# Altium schematic sheet Wireless_thermometer_BLE_module.SchDoc
size A4 portrait; SheetNumber: 1; SheetTotal: 2
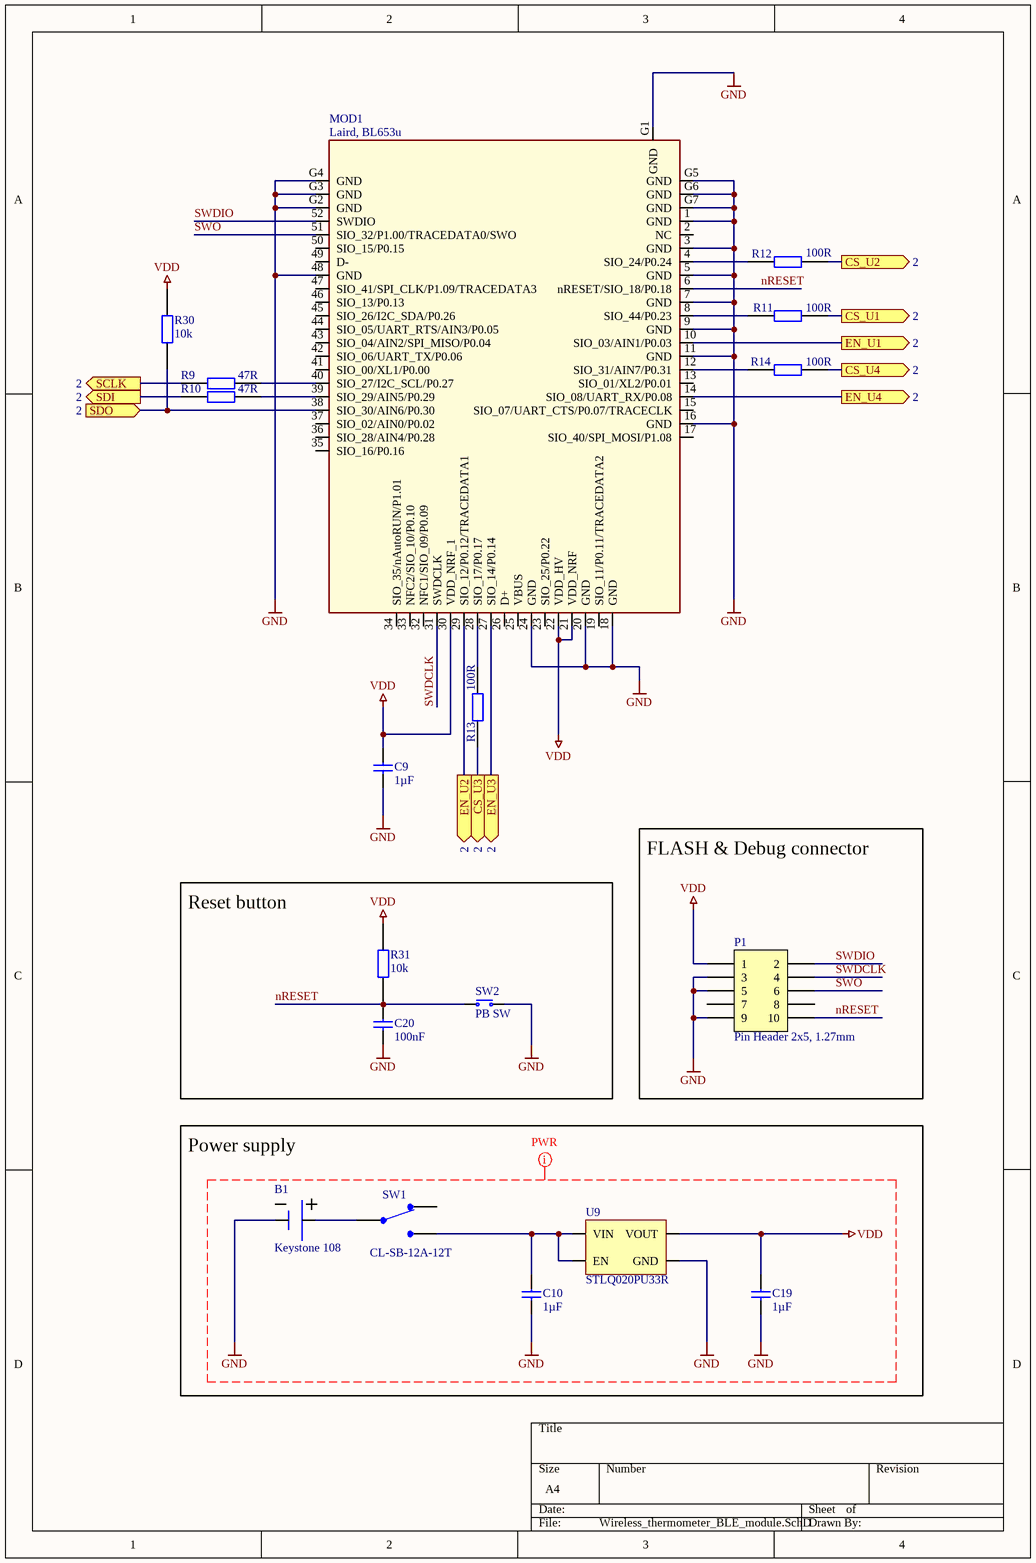
[diagram p0: Wireless_thermometer_BLE_module.SchDoc]

## Parts
B1  Keystone 108  [Keystone 108]
C9  1µF  [CAPC1005X04L]
C10  1µF  [CAPC1005X04L]
C19  1µF  [CAPC1005X04L]
C20  100nF  [CAPC1005X04L]
MOD1  Laird, BL653u  [Laird, BL653u]
P1  Pin Header 2x5, 1.27mm  [HDR_2x5-SMD-1.27mm-K]
R9  47R  [RESC1005X04L]
R10  47R  [RESC1005X04L]
R11  100R  [RESC1005X04L]
R12  100R  [RESC1005X04L]
R13  100R  [RESC1005X04L]
R14  100R  [RESC1005X04L]
R30  10k  [RESC1005X04L]
R31  10k  [RESC1005X04L]
SW1  CL-SB-12A-12T  [CL-SB-12A-12T]
SW2  PB SW  [C&K_PTS810]
U9  STLQ020PU33R  [STLQ020PU33R]

## Ports
CS_U1 (out, see 2), CS_U2 (out, see 2), CS_U3 (out, see 2), CS_U4 (out, see 2), EN_U1 (out, see 2), EN_U2 (out, see 2), EN_U3 (out, see 2), EN_U4 (out, see 2), SCLK (out, see 2), SDI (out, see 2), SDO (in, see 2)

## Nets
GND: B1.2 C9.1 C10.1 C19.1 C20.1 MOD1.1(GND) MOD1.3(GND) MOD1.5(GND) MOD1.7(GND) MOD1.9(GND) MOD1.11(GND) MOD1.16(GND) MOD1.18(GND) MOD1.20(GND) MOD1.24(GND) MOD1.48(GND) MOD1.G1(GND) MOD1.G2(GND) MOD1.G3(GND) MOD1.G4(GND) MOD1.G5(GND) MOD1.G6(GND) MOD1.G7(GND) P1.3 P1.5 P1.9 SW2.1(N.O) U9.3(GND)
VDD: C9.2 C19.2 MOD1.21(VDD_NRF) MOD1.22(VDD_HV) MOD1.30(VDD_NRF_1) P1.1 R30.2 R31.2 U9.1(VOUT)
CS_U1: R11.2 ; port CS_U1
CS_U2: R12.2 ; port CS_U2
CS_U3: R13.2 ; port CS_U3
CS_U4: R14.2 ; port CS_U4
EN_U1: MOD1.10(SIO_03/AIN1/P0.03) ; port EN_U1
EN_U2: MOD1.29(SIO_12/P0.12/TRACEDATA1) ; port EN_U2
EN_U3: MOD1.27(SIO_14/P0.14) ; port EN_U3
EN_U4: MOD1.14(SIO_08/UART_RX/P0.08) ; port EN_U4
nRESET: C20.2 MOD1.6(nRESET/SIO_18/P0.18) P1.10 R31.1 SW2.2(COM)
SCLK: R9.1 ; port SCLK
SDI: R10.1 ; port SDI
SDO: MOD1.38(SIO_30/AIN6/P0.30) R30.1 ; port SDO
SWDCLK: MOD1.31(SWDCLK) P1.4
SWDIO: MOD1.52(SWDIO) P1.2
SWO: MOD1.51(SIO_32/P1.00/TRACEDATA0/SWO) P1.6
NetB1_1: B1.1 SW1.2
NetC10_2: C10.2 SW1.3 U9.4(EN) U9.6(VIN)
NetMOD1_4: MOD1.4(SIO_24/P0.24) R12.1
NetMOD1_8: MOD1.8(SIO_44/P0.23) R11.1
NetMOD1_12: MOD1.12(SIO_31/AIN7/P0.31) R14.1
NetMOD1_28: MOD1.28(SIO_17/P0.17) R13.1
NetMOD1_39: MOD1.39(SIO_29/AIN5/P0.29) R10.2
NetMOD1_40: MOD1.40(SIO_27/I2C_SCL/P0.27) R9.2

Not connected (* = marked no-connect by the designer): MOD1 2(NC) 13(SIO_01/XL2/P0.01) 15(SIO_07/UART_CTS/P0.07/TRACECLK) 17(SIO_40/SPI_MOSI/P1.08) 19(SIO_11/P0.11/TRACEDATA2) 23(SIO_25/P0.22___________) 25(VBUS) 26(D+) 32(NFC1/SIO_09/P0.09) 33(NFC2/SIO_10/P0.10) 34(SIO_35/nAutoRUN/P1.01) 35(SIO_16/P0.16) 36(SIO_28/AIN4/P0.28) 37(SIO_02/AIN0/P0.02) 41(SIO_00/XL1/P0.00) 42(SIO_06/UART_TX/P0.06) 43(SIO_04/AIN2/SPI_MISO/P0.04) 44(SIO_05/UART_RTS/AIN3/P0.05) 45(SIO_26/I2C_SDA/P0.26) 46(SIO_13/P0.13) 47(SIO_41/SPI_CLK/P1.09/TRACEDATA3) 49(D-) 50(SIO_15/P0.15); P1 7 8; SW1 1

## Layout directives
net class PWR: GND, VDD

## Notes on the sheet
- Reset button
- (near P1) FLASH & Debug connector
- Power supply

## Library data of the parts
B1 = Keystone 108: Tip Plg 108 Phe Bagged NKL#9HHS108; Manufacturer: Keystone Electronics; Manufacturer Part Number: 108; Body Material: Plastic; Number of Batteries: 1; Lead Length: 3.56mm; Approvals: UL; Supplier 1: Digi-Key; RoHS: Yes; Category: Batteries and Accessories; Stock 1: 10973; Pricing 1: 1=1,50000, 25=1,27160, 100=1,04920, 250=0,96544, 500=0,90634, 1000=0,84723, 2500=0,76842, 5000=0,70931 (USD); Mount: Through Hole,PCB,Screw; Number of Pins: 2; Material: Brass,Plastic; Contact Plating: Nickel,Tin; Contact Material: Brass,Nickel; Min Operating Temperature: -50°C; Max Operating Temperature: 145°C; Package Quantity: 1; Packaging: Tray; Termination: PC Pin; Number of Cells: 1; Series: -; Lead Free: Lead Free; REACH SVHC: No SVHC; ComponentLink1URL: https://datasheet.ciiva.com/3/108-3991.pdf?src-supplier=Digi-Key; ComponentLink1Description: https://datasheet.ciiva.com/3/108-3991.pdf?src-supplier=Digi-Key; ComponentLink2URL: https://datasheet.ciiva.com/1391/1718250-1391263.pdf?src-supplier=Element14; ComponentLink2Description: https://datasheet.ciiva.com/1391/1718250-1391263.pdf?src-supplier=Element14; ComponentLink3URL: https://datasheet.ciiva.com/20221/18-0102-20221614.pdf?src-supplier=Rapid+Electronics; ComponentLink3Description: https://datasheet.ciiva.com/20221/18-0102-20221614.pdf?src-supplier=Rapid+Electronics; ComponentLink4URL: https://datasheet.ciiva.com/20221/18-2995-20221661.pdf?src-supplier=Rapid+Electronics; ComponentLink4Description: https://datasheet.ciiva.com/20221/18-2995-20221661.pdf?src-supplier=Rapid+Electronics; ComponentLink5URL: https://datasheet.ciiva.com/16322/m60-2p18-16322534.pdf?src-supplier=Future+Electronics; ComponentLink5Description: https://datasheet.ciiva.com/16322/m60-2p18-16322534.pdf?src-supplier=Future+Electronics; Supplier Part Number 1: 36-108-ND
C9 C10 C19 C20 = CAP_0402: Capacitor, X7R, ±10%; Part Number: C0402-1µ0; LatestRevisionDate: 2016-08-22; Pin Count: 2; Publisher: Nordic Semiconductor; Published: 2009-05-08; Footprint Doc: 0402
  C9 C10 C19: Value: 1µF
  C20: Value: 100nF
MOD1 = Laird, BL653u: BL653µ Integrated Antenna module, 453-00059; Substitutes Allowed: NO; Datasheet Link: https://connectivity-staging.s3.us-east-2.amazonaws.com/s3fs-public/2018-12/BL654%20Datasheet%20v1_6.pdf; Mounting: SMT; Operating Temperature: -40C~85C; Manufacturer Part Number: 453-00059; Manufacturer: Laird; Footprint: Laird, Module, BL653u-SA
P1 = Pin Header 2x5 SMD, 1.27mm, KS: Pin Header 2x5, 1.27mm (50mil), SMD, Keying Shroud; Manufacturer: W-CON; Manufacturer Part Number: 3132-10MS0BK00R1; Part number IPS: 00000009968; Artikkelnr Noca: 55010009; Part Number: Pin Header 2x5 SMD, 1.27mm, KS; Footprint Doc: HDR_2x5-SMD-1.27mm; LatestRevisionDate: 2016-04-21; Pin Count: 10; Publisher: Nordic Semiconductor; Published: 2016-01-22; Value: Pin Header 2x5, 1.27mm; Note: *; ComponentLink1URL: *; ComponentLink1Description: Datasheet; ComponentLink2URL: *; ComponentLink2Description: Supplier link; HelpURL: \\hizz\pro\app9717\Datasheet\connectores\W-CON\3132-XXMXXBK00XX.pdf; Supplier 1: Cabcon; Supplier Part Number 1: 3132-10MS0BK00R1; Supplier 2: Samtec; Supplier Part Number 2: FTSH-105-01-F-DV-K
R9 R10 = RES_0402: Resistor; Part Number: R0603-430R; Value: 430R; LatestRevisionDate: 2015-06-10; Pin Count: 2; Publisher: Nordic Semiconductor; Published: 2015-06-10; Footprint Doc: 0603
R11-R14 R30 R31 = RES_0402: Resistor; Part Number: R0603-430R; LatestRevisionDate: 2015-06-10; Pin Count: 2; Publisher: Nordic Semiconductor; Published: 2015-06-10; Footprint Doc: 0603
  R11-R14: Value: 100R
  R30 R31: Value: 10k
SW1 = CL-SB-12A-12T: Slide Switch, 2 Positions, SPDT, Latched, 0.2A, 12VDC, Solder Terminal, Through Hole-right Angle; Manufacturer: Nidec Copal; Actuator Material: Nylon,Polyamide; Contact Style: Non-Shorting; Electrical Life: 10000Cycles; Actuator Type: Standard; Switch Function: On-On; Switch Travel: 2mm; Current Rating: 200mA; Voltage Rating (DC): 12V; Operating Force: 153gf; Supplier 1: Newark; Manufacturer Part Number: CL-SB-12A-12T; RoHS: Yes; Category: Slide Switches; Stock 1: 490; Pricing 1: 1=1,08000, 10=1,03000, 25=0,97200, 50=0,91300, 100=0,85000, 250=0,78000 (USD); Mount: Surface Mount; Contact Plating: Gold; Contact Material: Copper; Min Operating Temperature: -40°C; Max Operating Temperature: 85°C; Throw Configuration: SPDT; Packaging: Tape and Reel; Actuator Length: 2mm; ComponentLink1URL: https://datasheet.ciiva.com/6462/cl-sb-6462005.pdf?src-supplier=Digi-Key; ComponentLink1Description: https://datasheet.ciiva.com/6462/cl-sb-6462005.pdf?src-supplier=Digi-Key; ComponentLink2URL: https://datasheet.ciiva.com/6462/cl-sb-6462006.pdf?src-supplier=Digi-Key; ComponentLink2Description: https://datasheet.ciiva.com/6462/cl-sb-6462006.pdf?src-supplier=Digi-Key; ComponentLink3URL: https://datasheet.ciiva.com/6462/cl-sb-6462009.pdf?src-supplier=Digi-Key; ComponentLink3Description: https://datasheet.ciiva.com/6462/cl-sb-6462009.pdf?src-supplier=Digi-Key; Supplier Part Number 1: 56AC5276
SW2 = PTS810 SJK 250 SMTR LFS: Tactile Switch, SPNO, SMD, 260gf, 4.2x3.2x2.5mm; Manufacturer: C&K Components; Part number IPS: 00000001259; Artikkelnr Noca: N.A.; Part Number: PTS810 SJK 250 SMTR LFS; Manufacturer Part Number: PTS810 SJK 250 SMTR LFS; LatestRevisionDate: 2017-11-09; Pin Count: 4; Publisher: Nordic Semiconductor; Published: 2017-09-18; Value: PB SW; Note: *; Footprint Doc: PTS810; ComponentLink1Description: Datasheet; ComponentLink1URL: *; ComponentLink2Description: Supplier link; ComponentLink2URL: *; HelpURL: http://www.ckswitches.com/media/1476/pts810.pdf; Supplier 1: Digi-Key; Supplier Part Number 1: CKN10503TR-ND; Supplier 2: *; Supplier Part Number 2: *
U9 = STLQ020PU33R: Ldo, Fixed, 3.3V, 0.2A, -40 to 125DEG C;; Manufacturer: STMicroelectronics; Supplier 1: Mouser; Manufacturer Part Number: STLQ020PU33R; RoHS: No; Category: Uncategorized; Stock 1: 5768; Pricing 1: 1=0,60000, 10=0,49400, 50=0,49400, 100=0,40300, 1000=0,25500, 10000=0,24000 (USD); Supplier Part Number 1: 511-STLQ020PU33R